# EAGLE design akabeacon_square_type2_MDBT40 (EAGLE 7.4.0)
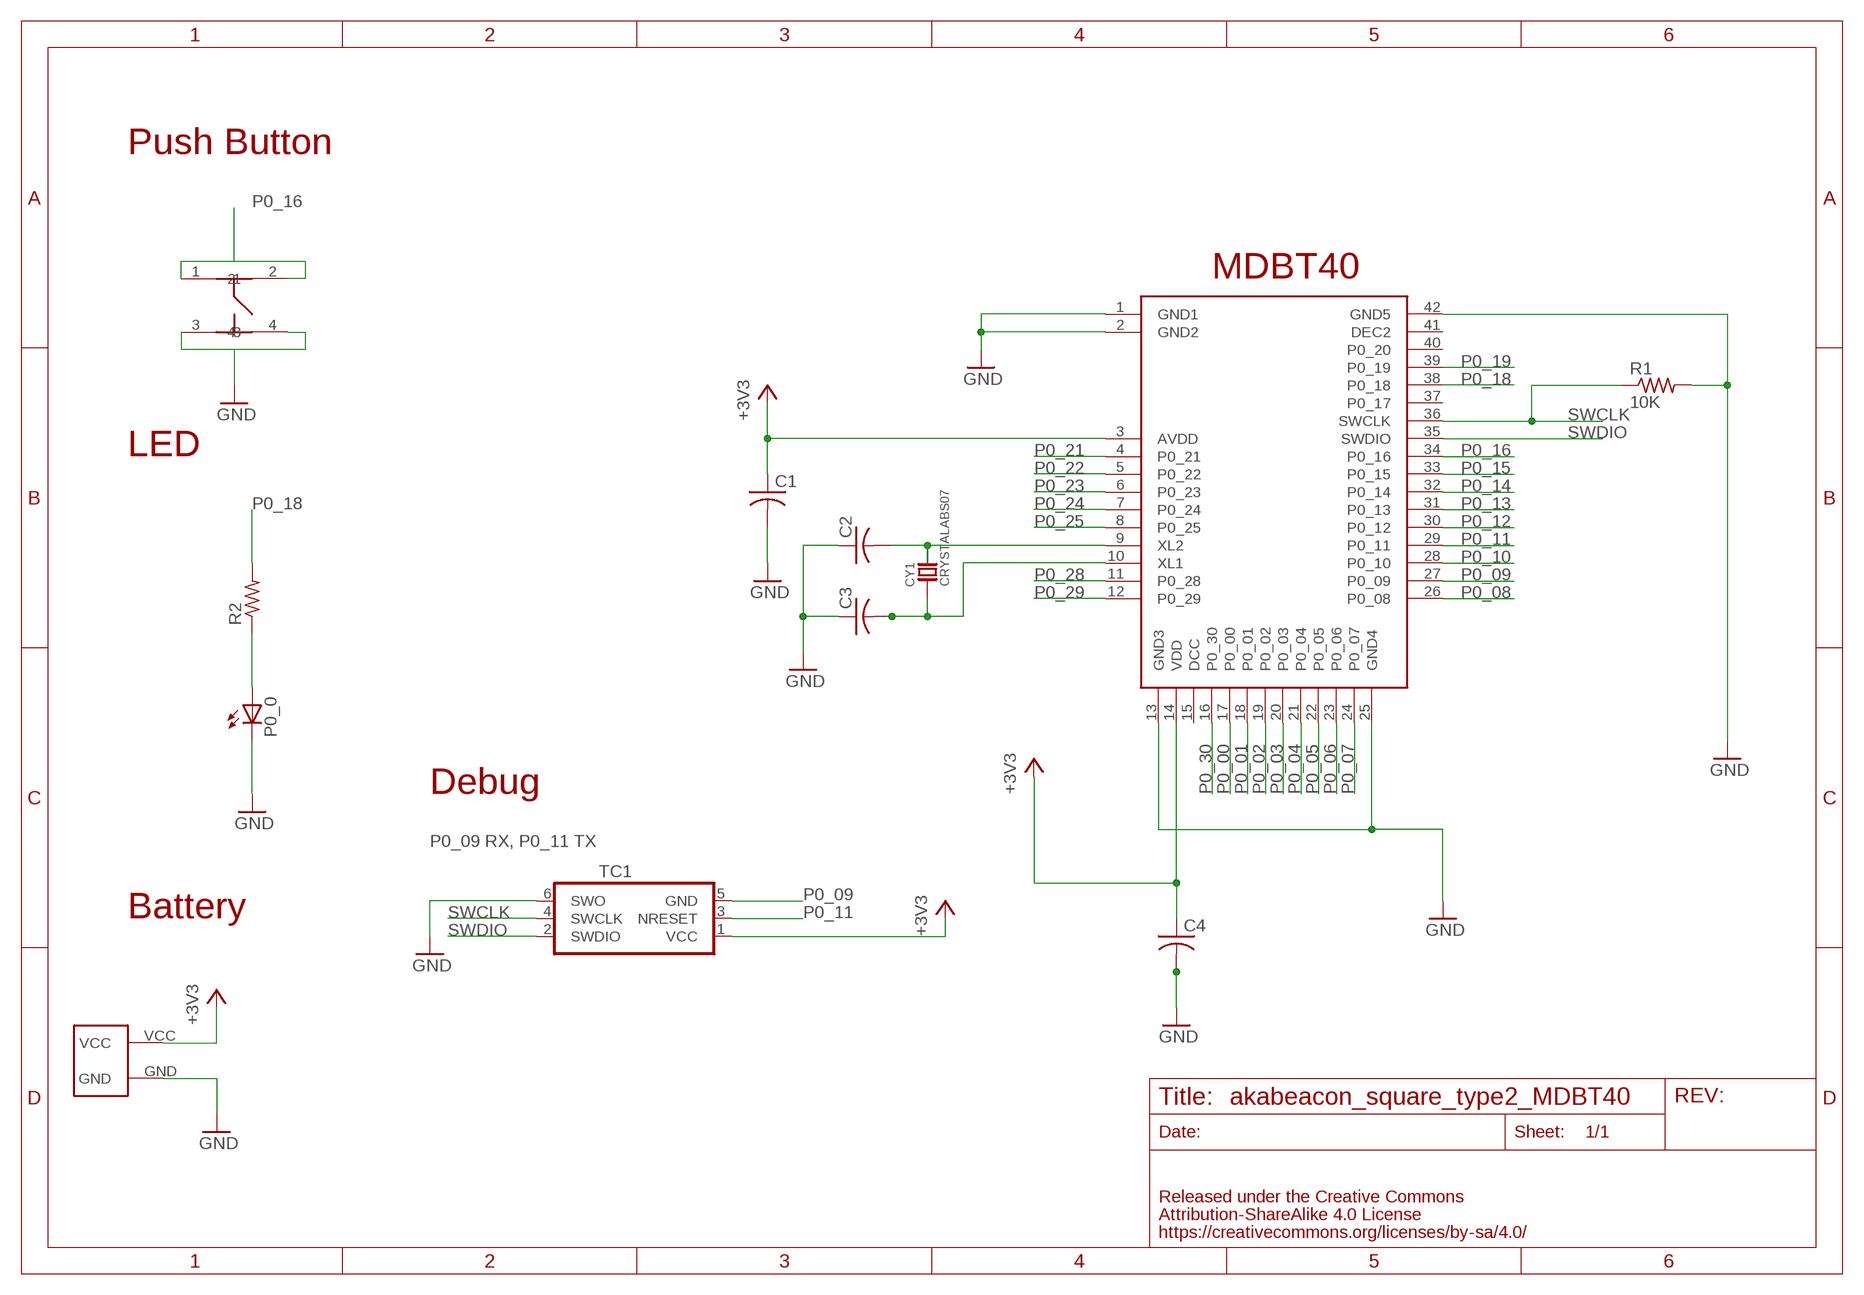
[diagram p0: schematic, sheet 1]

## Parts
C1  C-USC0603  [C0603]
C2  C-USC0603  [C0603]
C3  C-USC0603  [C0603]
C4  C-USC0603  [C0603]
CY1  CRYSTALABS07  [ABRACOM-ABS07-32.768KHZ]
P0_0  LEDCHIP-LED0603  [CHIP-LED0603]
R1  10K  R-US_R0603  [R0603]
R2  R-US_R0603  [R0603]
TC1  TC2030-IDC-NL  [TC2030-IDC-NL]
U$2  SQUARE-TYPE2-TC2030  [SQUARE-TYPE2-TC2030]
U$3  RAYTAC-MDBT40  [RAYTAC-MDBT40]
U$6  SWICTH-4P(KMR2)  [SWITCH-4P(KMR2)]

## Nets
+3V3: C1.1 C4.1 TC1.1(VCC) U$2.VCC U$3.3(AVDD) U$3.14(VDD)
GND: C1.2 C2.1 C3.1 C4.2 P0_0.C R1.2 TC1.6(SWO) U$2.GND U$3.1(GND1) U$3.2(GND2) U$3.13(GND3) U$3.25(GND4) U$3.42(GND5) U$6.3 U$6.4
N$1: P0_0.A R2.1
N$7: C2.2 CY1.P$2 U$3.9(XL2)
N$8: C3.2 CY1.P$1 U$3.10(XL1)
P0_00: U$3.17(P0_00)
P0_01: U$3.18(P0_01)
P0_02: U$3.19(P0_02)
P0_03: U$3.20(P0_03)
P0_04: U$3.21(P0_04)
P0_05: U$3.22(P0_05)
P0_06: U$3.23(P0_06)
P0_07: U$3.24(P0_07)
P0_08: U$3.26(P0_08)
P0_09: TC1.5(GND) U$3.27(P0_09)
P0_10: U$3.28(P0_10)
P0_11: TC1.3(NRESET) U$3.29(P0_11)
P0_12: U$3.30(P0_12)
P0_13: U$3.31(P0_13)
P0_14: U$3.32(P0_14)
P0_15: U$3.33(P0_15)
P0_16: U$3.34(P0_16) U$6.1 U$6.2
P0_18: R2.2 U$3.38(P0_18)
P0_19: U$3.39(P0_19)
P0_21: U$3.4(P0_21)
P0_22: U$3.5(P0_22)
P0_23: U$3.6(P0_23)
P0_24: U$3.7(P0_24)
P0_25: U$3.8(P0_25)
P0_28: U$3.11(P0_28)
P0_29: U$3.12(P0_29)
P0_30: U$3.16(P0_30)
SWCLK: R1.1 TC1.4(SWCLK) U$3.36(SWCLK)
SWDIO: TC1.2(SWDIO) U$3.35(SWDIO)
Unconnected: U$3.15(DCC) U$3.37(P0_17) U$3.40(P0_20) U$3.41(DEC2)

## Notes on the sheet
- Push Button
- MDBT40
- LED
- Debug
- P0_09 RX, P0_11 TX
- Battery

## Library data of the parts
C1-C4 = adafruit:C-US: CAPACITOR, American symbol
CY1 = FaBo-Crystal:CRYSTAL
P0_0 = led:LED: LED OSRAM: - CHIPLED LG R971, LG N971, LY N971, LG Q971, LY Q971, LO R971, LY R971 LH N974, LH R974 LS Q976, LO Q976, LY Q976 LO Q996 - Hyper CHIPLED LW Q18S LB Q993, LB Q99A, LB R99A - SideLED LS A670, LO A670, LY A670, LG A670, LP A670 LB A673, LV A673, LT A673, LW A673 LH A674 LY A675 LS A676, LA A676, LO A676, LY A676, LW A676 LS A679, LY A679, LG A679 - Hyper Micro SIDELED® LS Y876, LA Y876, LO Y876, LY Y876 LT Y87S - SmartLED LW L88C, LW L88S LB L89C, LB L89S, LG L890 LS L89K, LO L89K, LY L89K LS L896, LA L896, LO L896, LY L896 - TOPLED LS T670, LO T670, LY T670, LG T670, LP T670 LSG T670, LSP T670, LSY T670, LOP T670, LYG T670 LG T671, LOG T671, LSG T671 LB T673, LV T673, LT T673, LW T673 LH T674 LS T676, LA T676, LO T676, LY T676, LB T676, LH T676, LSB T676, LW T676 LB T67C, LV T67C, LT T67C, LS T67K, LO T67K, LY T67K, LW E67C LS E67B, LA E67B, LO E67B, LY E67B, LB E67C, LV E67C, LT E67C LW T67C LS T679, LY T679, LG T679 LS T770, LO T770, LY T770, LG T770, LP T770 LB T773, LV T773, LT T773, LW T773 LH T774 LS E675, LA E675, LY E675, LS T675 LS T776, LA T776, LO T776, LY T776, LB T776 LHGB T686 LT T68C, LB T68C - Hyper Mini TOPLED® LB M676 - Mini TOPLED Santana® LG M470 LS M47K, LO M47K, LY M47K Source: http://www.osram.convergy.de LUXEON: - LUMILED® LXK2-PW12-R00, LXK2-PW12-S00, LXK2-PW14-U00, LXK2-PW14-V00 LXK2-PM12-R00, LXK2-PM12-S00, LXK2-PM14-U00 LXK2-PE12-Q00, LXK2-PE12-R00, LXK2-PE12-S00, LXK2-PE14-T00, LXK2-PE14-U00 LXK2-PB12-K00, LXK2-PB12-L00, LXK2-PB12-M00, LXK2-PB14-N00, LXK2-PB14-P00, LXK2-PB14-Q00 LXK2-PR12-L00, LXK2-PR12-M00, LXK2-PR14-Q00, LXK2-PR14-R00 LXK2-PD12-Q00, LXK2-PD12-R00, LXK2-PD12-S00 LXK2-PH12-R00, LXK2-PH12-S00 LXK2-PL12-P00, LXK2-PL12-Q00, LXK2-PL12-R00 Source: www.luxeon.com KINGBRIGHT: KA-3528ASYC Source: www.kingbright.com
R1 R2 = adafruit:R-US_: RESISTOR, American symbol
TC1 = TagConnect:TC2030-IDC: Tag-Connect In Circuit Programming & Debug Cable 6 Pin http://www.tag-connect.com
U$2 = FaBo-Template:SQUARE-TYPE2-TC2030
U$3 = gclueBT:RAYTAC-MDBT40
U$6 = gclue-test:SWICTH-4P(KMR2)

## Board
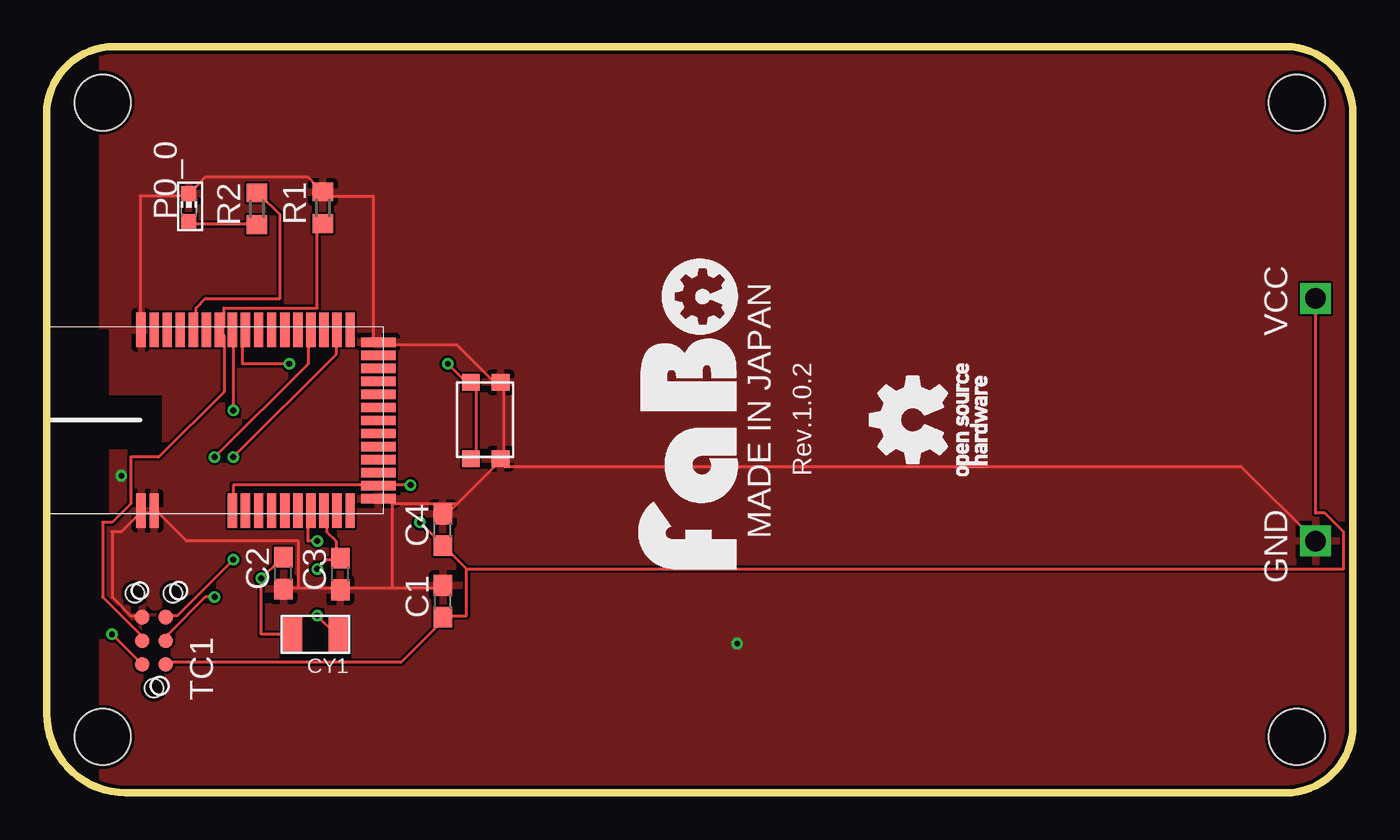
[diagram p1: board, top side]
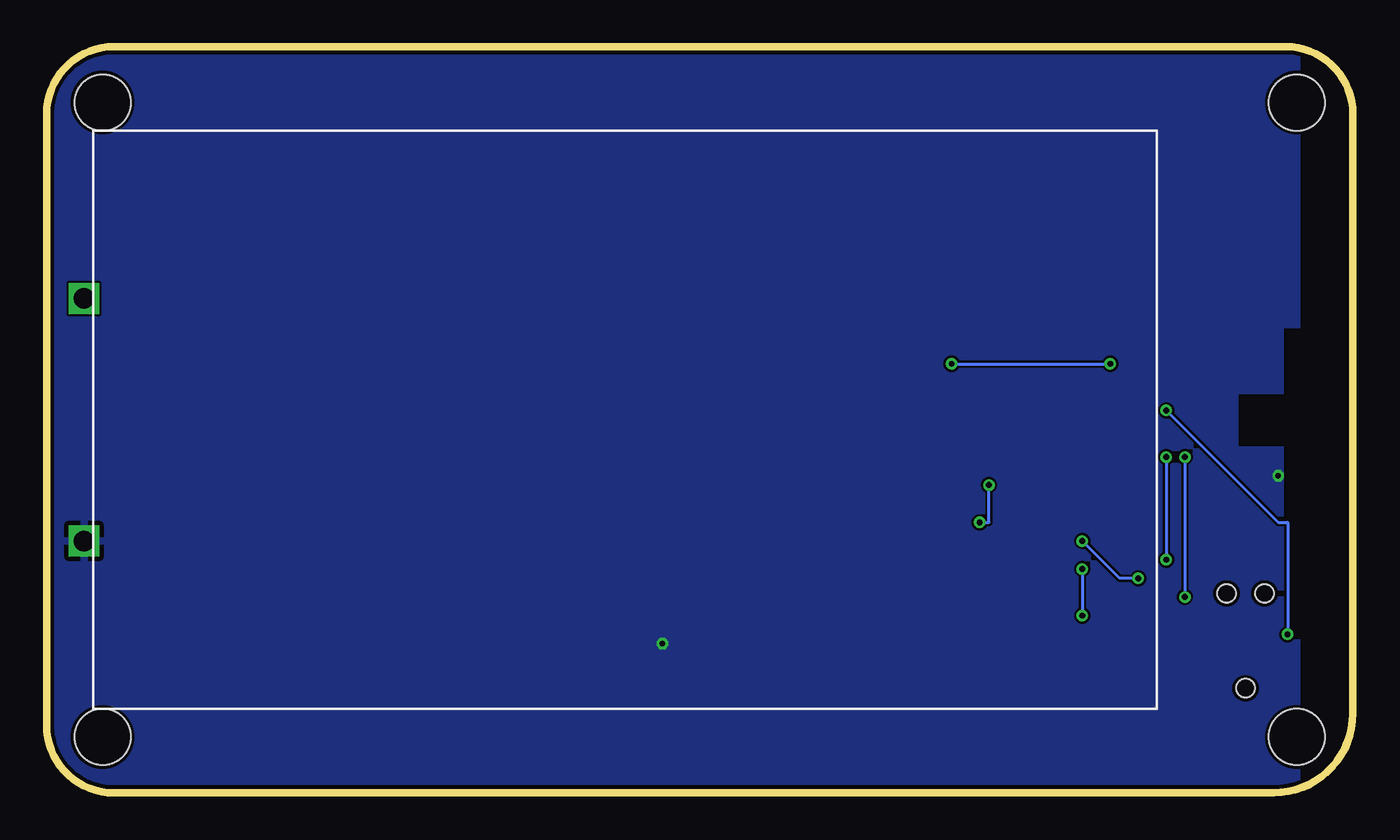
[diagram p2: board, bottom side, seen from below]

Size 70 x 40 mm. Coordinates in mm from the lower left corner, seen from the top.
Copper layers (1*16): Top 0.035mm / dielectric 1.5mm / Bottom 0.035mm
Design rules "SeeedStudio_2layer_DRU_no_angle_20140221 *": minimum track width 6mil, minimum drill 12mil, track to track 5mil, track to pad 5mil, pad to pad 5mil, via to via 5mil, smd to smd 0mil, copper to edge 8mil, drill to drill 8mil, minimum pad ring 10mil, minimum via ring 6mil, stop-mask expansion 2mil, vias tented up to drill 100mil, thermal gap 10mil
tRestrict: area -1.3,14.7 to 3.3,24.8; area 3.4,18.4 to 6.2,21.3
bRestrict: area -1.3,14.7 to 3.7,24.9; area 3.2,18.6 to 6.1,21.4

### Footprints (pad centres in the part's own frame; a part is rotated, then mirrored left to right if it is on the bottom)
C0603 = smd 1.1 x 1: 1 -0.85,0; 2 0.85,0
ABRACOM-ABS07-32.768KHZ = smd 1.1 x 1.9: P$1 -1.25,0; P$2 1.25,0
CHIP-LED0603 = smd 0.8 x 0.8: A 0,-0.75; C 0,0.75
R0603 = smd 1 x 1.1: 1 -0.85,0; 2 0.85,0
TC2030-IDC-NL = smd 0.787 x 0.787: 1 -1.27,-0.635; 2 -1.27,0.635; 3 0,-0.635; 4 0,0.635; 5 1.27,-0.635; 6 1.27,0.635 | hole 0.991: -2.54,0; 2.54,1.016; 2.54,-1.016
SQUARE-TYPE2-TC2030 = drill 1.1 square: GND 33,-6.5; VCC 33,6.5 | hole 3: -32,17; -32,-17; 32,-17; 32,17
RAYTAC-MDBT40 = smd 1.85 x 0.5: 1 -4.86,4; 2 -4.86,3.3; 3 -4.86,-0.9; 4 -4.86,-1.6; 5 -4.86,-2.3; 6 -4.86,-3; 7 -4.86,-3.7; 8 -4.86,-4.4; 9 -4.86,-5.1; 10 -4.86,-5.8; 11 -4.86,-6.5; 12 -4.86,-7.2; 26 4.84,-7.2; 27 4.84,-6.5; 28 4.84,-5.8; 29 4.84,-5.1; 30 4.84,-4.4; 31 4.84,-3.7; 32 4.84,-3; 33 4.84,-2.3; 34 4.84,-1.6; 35 4.84,-0.9; 36 4.84,-0.2; 37 4.84,0.5; 38 4.84,1.2; 39 4.84,1.9; 40 4.84,2.6; 41 4.84,3.3; 42 4.84,4 | smd 0.5 x 1.85: 13 -4.22,-8.71; 14 -3.52,-8.71; 15 -2.82,-8.71; 16 -2.12,-8.71; 17 -1.42,-8.71; 18 -0.72,-8.71; 19 -0.02,-8.71; 20 0.68,-8.71; 21 1.38,-8.71; 22 2.08,-8.71; 23 2.78,-8.71; 24 3.48,-8.71; 25 4.18,-8.71
SWITCH-4P(KMR2) = smd 0.9 x 0.95: 1 -1,0; 2 3.1,0; 3 -1,-1.6; 4 3.1,-1.6

### Placement (x,y rotation side)
C1  21.24,10.27 90 top
C2  12.69,11.78 90 top
C3  15.74,11.73 90 top
C4  21.23,14.09 90 top
CY1  14.4,8.5 180 top
P0_0  7.62,31.38 0 top
R1  14.8,31.36 90 top
R2  11.27,31.31 90 top
TC1  5.75,8.15 90 top
U$2  35,20 0 top
U$3  9.06,19.98 90 top
U$6  22.73,18.91 90 top

### Tracks (layer width: path | path; a pad name or v marks a point on that pad's centre or on a via)
+3V3  (via drill 0.3)
  Top 0.152: U$3.3 10,15.5 10,16.5 17.5,16.5 U$3.14 18,16.5 v19.5,16.5 | TC1.1 6.5,7 19,7 21,9 C1.1 21.5,9.5 22.5,9.5 22.5,12 | 22.5,12 21.5,13 C4.1 21,13.5 v20,14.5 | U$2.VCC 68,15 68.5,15 69.5,14 69.5,12 22.5,12
  Bottom 0.152: v19.5,16.5 19.5,14.5 v20,14.5
GND  (via drill 0.3)
  Top 0.152: 5,15 4,14 3.5,14 3.5,10.5 4.5,9.5 5,9.5 TC1.6 | 5,15 6,15 | 5,15 U$3.1 | 13.5,11 13,11 C2.1 | 13.5,11 15.5,11 C3.1 16,11 18.5,11 | 18.5,11 21,11 C1.2 | 6,15 7.5,13.5 13.5,13.5 13.5,11 | 6,15 U$3.2 | U$3.42 5,25 5,32 7.5,32 P0_0.C 8,32.5 8.5,33 14,33 14.5,32.5 R1.2 15,32 17.5,32 17.5,24 U$3.25 18,24 22,24 24,22 U$6.4 24.5,22 24.5,18 U$6.3 | 22,15.5 21.5,15 C4.2 | 22,15.5 24,17.5 U$6.3 | 18.5,15.5 18,16 U$3.13 | 22,15.5 18.5,15.5 | U$2.GND 64,17.5 24.5,17.5 U$6.3 | 18.5,15.5 18.5,11
  other vias: 37,8 4,17
  pour Top: 3,-1 71,-1 71,42 3,42
  pour Bottom: 3,-1 71,-1 71,42 3,42
N$1
  Top 0.152: P0_0.A 8,30.5 11,30.5 R2.1
N$7  (via drill 0.3)
  Top 0.152: CY1.P$2 11.5,8.5 v11.5,11.5 12.5,12.5 C2.2 | v14.5,13.5 14,13.5 14,15 U$3.9
  Bottom 0.152: v14.5,13.5 12.5,11.5 v11.5,11.5
N$8  (via drill 0.3)
  Top 0.152: U$3.10 15,15 15,14 15.5,13.5 15.5,13 C3.2 15.5,12.5 15,12.5 v14.5,12 | v14.5,9.5 15.5,8.5 CY1.P$1
  Bottom 0.152: v14.5,12 v14.5,9.5
P0_09  (via drill 0.3)
  Top 0.152: v10,12.5 7,9.5 6.5,9.5 TC1.5 | v10,18 15.5,23.5 15.5,24.5 U$3.27
  Bottom 0.152: v10,18 v10,12.5
P0_11  (via drill 0.3)
  Top 0.152: v9,10.5 8.5,10.5 6.5,8.5 TC1.3 | v9,18 14,23 14,24.5 U$3.29
  Bottom 0.152: v9,18 v9,10.5
P0_16  (via drill 0.3)
  Top 0.152: U$6.1 23,18 23,22 U$6.2 22.5,22 v21.5,23 | v13,23 10.5,23 10.5,24.5 U$3.34
  Bottom 0.152: v21.5,23 v13,23
P0_18
  Top 0.152: R2.2 11.5,32 12.5,31 12.5,26.5 8.5,26.5 8,26 8,25 U$3.38
SWCLK
  Top 0.152: TC1.4 5,8.5 3,10.5 3,14.5 3.5,14.5 4.5,15.5 4.5,18 6,18 9.5,21.5 9.5,24.5 U$3.36 9.5,25 9.5,26 14.5,26 14.5,30.5 R1.1
SWDIO  (via drill 0.3)
  Top 0.152: v3.5,8.5 5,7 TC1.2 | v10,20.5 10,24.5 U$3.35
  Bottom 0.152: v3.5,8.5 3.5,14.5 4,14.5 v10,20.5

### Text on the board
tPlace: Rev.1.0.2